# Altium schematic sheet ESP32 Power.SchDoc
size A; SheetNumber: 2; SheetTotal: 3
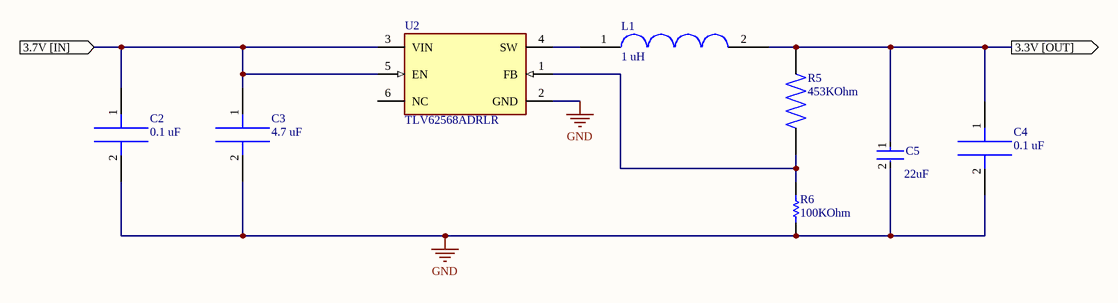
[diagram p0: ESP32 Power.SchDoc]

## Parts
C2  value 0.1 uF  [1206 Capacitor]  (hidden comment: GMC31X7R104K6R3NT)
C3  value 4.7 uF  [12101C47]  (hidden comment: 12101C475K4T2A)
C4  value 0.1 uF  [1206 Capacitor]  (hidden comment: GMC31X7R104K6R3NT)
C5  Capacitance: 22uF  [FP-GRM21B-0_15-MFG]  (hidden comment: GRM21BR60J226ME39L)
L1  1 uH  [TYA40121R0M-10]
R5  453KOhm  [RES_ERJP14F4533U]
R6  Resistance: 100KOhm  [RESC3116X65X40ML10T20]  (hidden comment: RC1206FR-07100KL)
U2  TLV62568ADRLR  [FP-DRL0006A-MFG]

## Ports
3.3V [OUT] (out, see ECEN404_Team54_V2[2B]), 3.7V [IN] (in, see ECEN404_Team54_V2[1A])

## Nets
GND: C2.2 C3.2 C4.2 C5.2 R6.1 U2.2(GND)
3.3V [OUT]: C4.1 C5.1 L1.2 R5.2 ; port 3.3V [OUT]
3.7V [IN]: C2.1 C3.1 U2.3(VIN) U2.5(EN) ; port 3.7V [IN]
NetL1_1: L1.1 U2.4(SW)
NetR5_1: R5.1 R6.2 U2.1(FB)

Not connected (* = marked no-connect by the designer): U2 6(NC)

## Library data of the parts
C2 C4 = GMC31X7R104K6R3NT: 0.1 µF ±10% 6.3V Ceramic Capacitor X7R 1206 (3216 Metric)
C3 = 12101C47: CAP CER 4.7UF 100V X7R 1210
C5 = CMP-2007-03385-2: Chip Multilayer Ceramic Capacitors for General Purpose, 0805, 22uF, X5R, 15%, 20%, 6.3V; Material: Ceramic; Max Operating Temperature: 85°C; Voltage: 6.3V; Min Operating Temperature: -55°C; Case/Package: 0805; Thickness: 0.053inch; Dielectric: X5R; Packaging: Tape and Reel; Depth: 1.25mm; Termination: SMD/SMT; Voltage Rating (DC): 6.3V; Radiation Hardening: No; Tolerance: 20%; Mount: Surface Mount; Lead Free: Lead Free; Package Quantity: 1; REACH SVHC: No SVHC; Voltage Rating: 6.3V; Length: 2mm; Case Code (Imperial): 0805; Case Code (Metric): 2012; Width: 0.049inch; Height: 1.25mm
L1 = TYA40121R0M-10: TYA40121R0M-10, FIXED IND 1UH 3A 59 MOHM SMD; Value: 1 uH
R5 = ERJP14F4533U: Price: None; Availability: Unavailable; Package: None; MP: ERJP14F4533U; Value: *
R6 = CMP-2100-03674-1: Chip Resistor, 100 KOhm, +/- 1%, 0.25 W, -55 to 155 degC, 1206 (3216 Metric), RoHS, Tape and Reel; Manufacturer: Yageo; Voltage Rating: 200V; Temperature Coefficient: 100ppm/degreesC; Power Rating: 250mW; Case Code (Metric): 3216; Composition: ThickFilm; Lead Free: LeadFree; Max Operating Temperature: 155degC; Case/Package: 1206; Min Operating Temperature: -55degC; Depth: 1.6mm; RoHSCompliant: true; Datasheet URL: http://www.yageo.com/NewPortal/yageodocoutput?fileName=/pdf/R-Chip/PYu-RC_Group_51_RoHS_L_5.pdf; Datasheet Version: Rev. 5, 10/2016; Package Reference: 1206.0; Packaging: TapeandReel; Manufacturer URL: http://www.yageo.com/; Tolerance: 1%; Height: 0.55mm; REACH SVHC: NoSVHC; Case Code (Imperial): 1206; Length: 3.1mm; Package Description: 2-Pin Surface Mount Device, Body 3.1 x 1.6 mm; Termination: SMD/SMT
U2 = CMP-04918-000153-1: IC REG BUCK ADJUSTABLE 2A SOT563; Min Output Voltage: 600mV; Max Output Voltage: 5.5V; Synchronous Rectifier: Yes; Min Input Voltage: 2.5V; Number of Outputs: 1; Switching Frequency: 1.5MHz; Output Configuration: Positive; Output Type: Adjustable; Output Current: 2A; Min Operating Temperature: -40°C; Case/Package: SOT-563; Packaging: Tape and Reel; Max Operating Temperature: 125°C; Max Input Voltage: 5.5V; Mount: Surface Mount